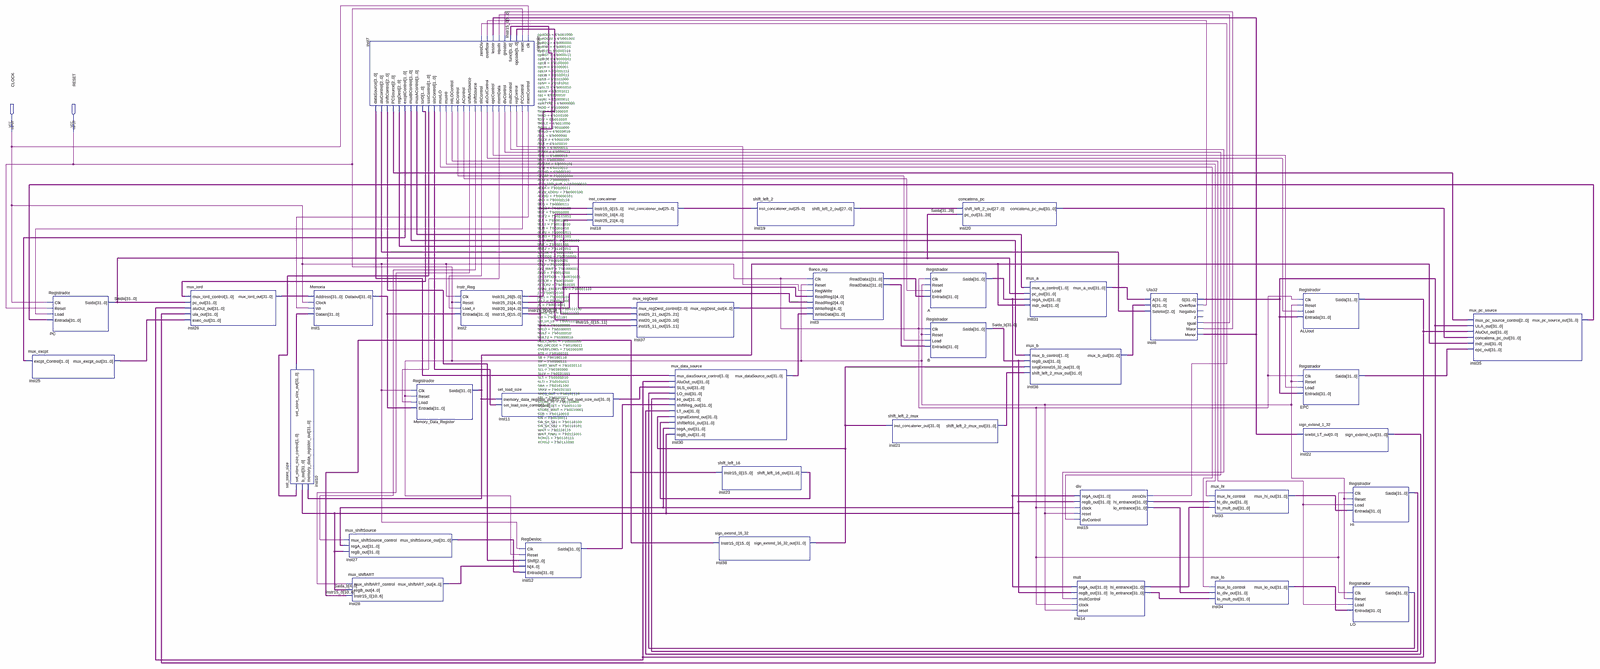
[diagram p0: schematic sheet, whole]
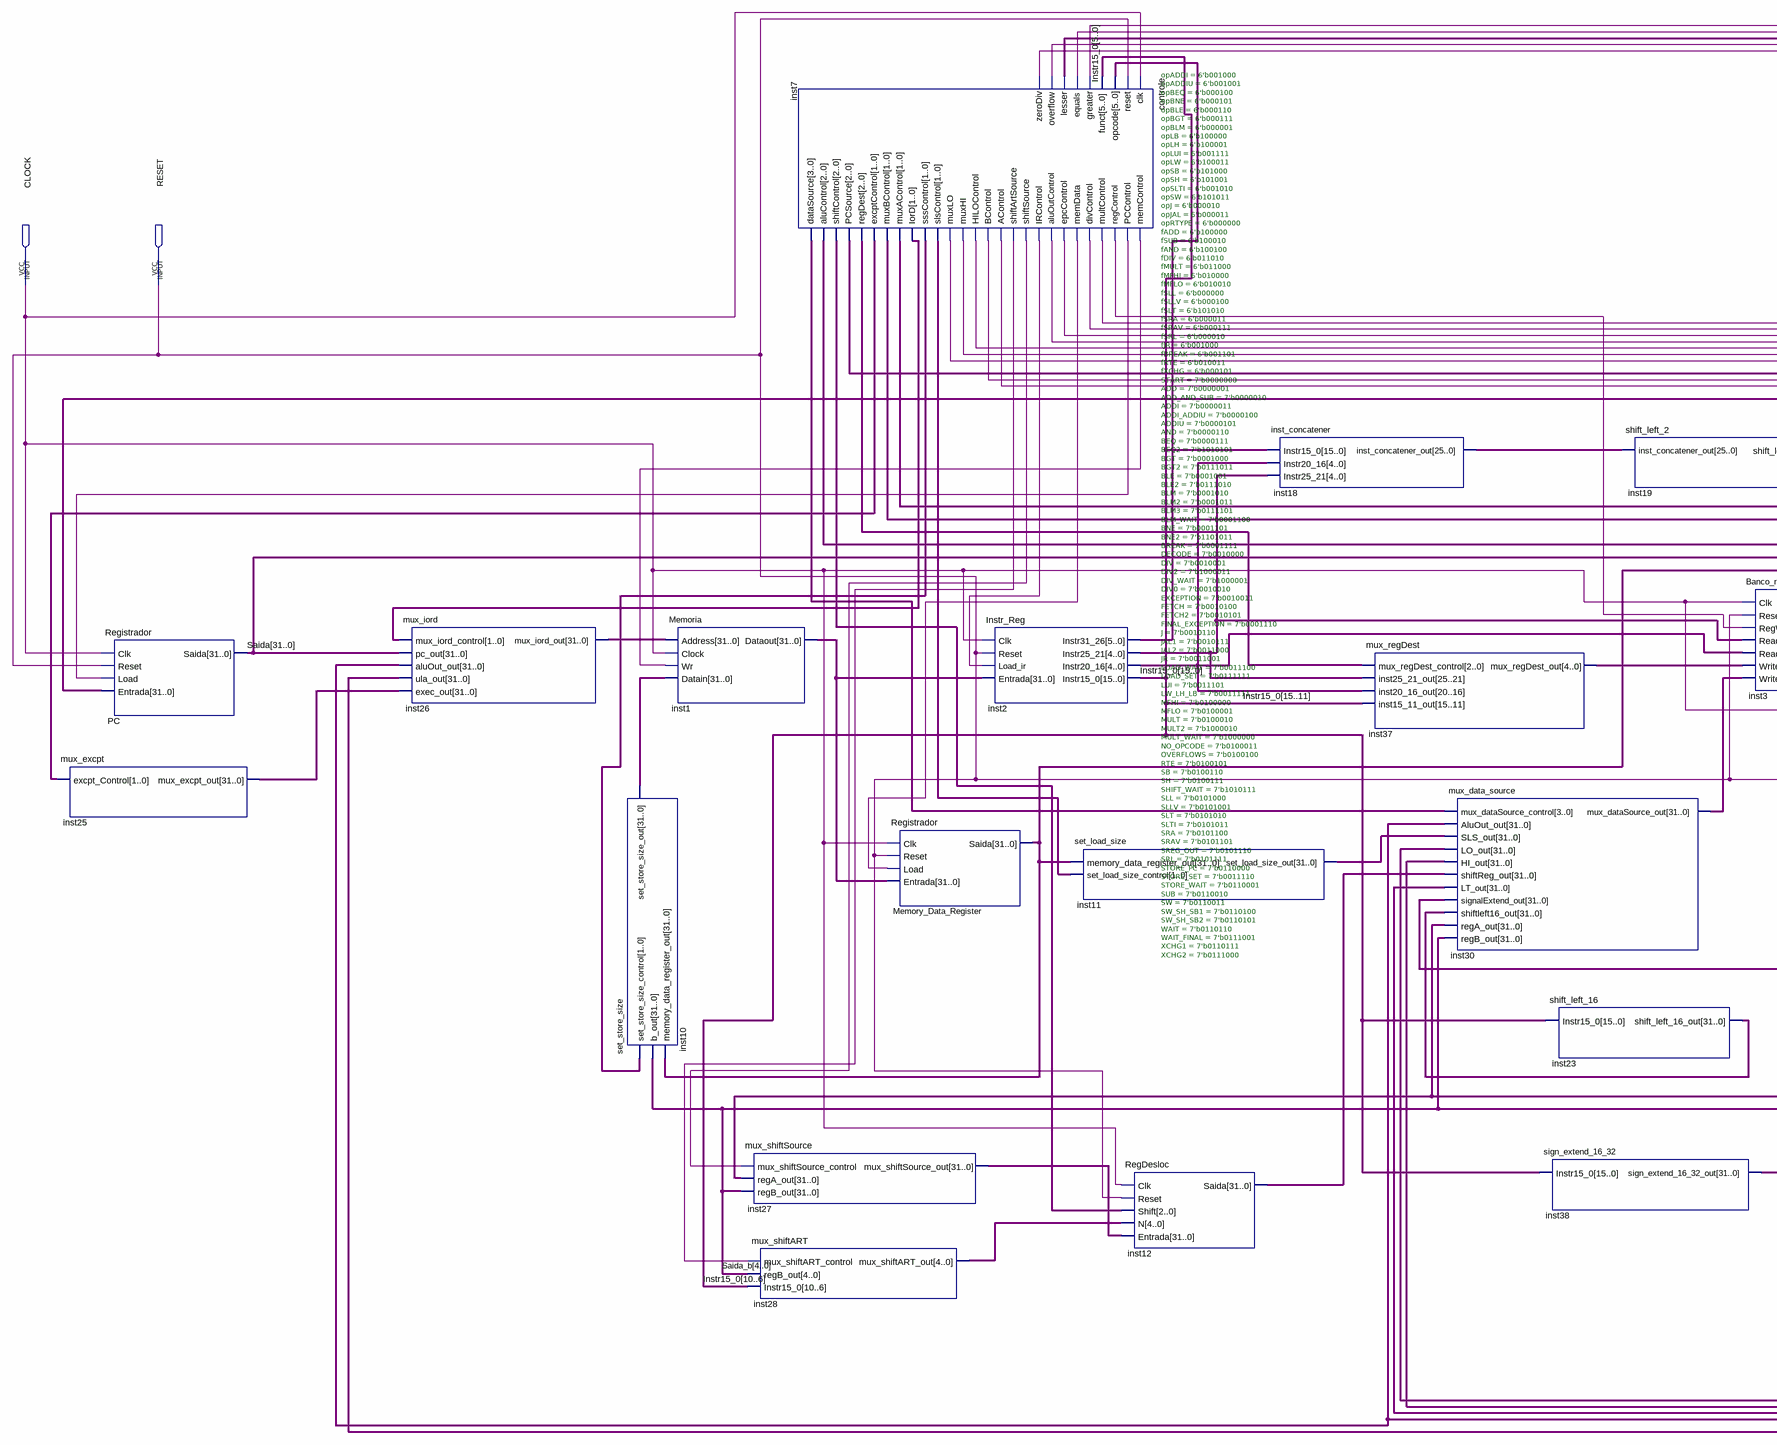
[diagram p1: schematic sheet, left part]
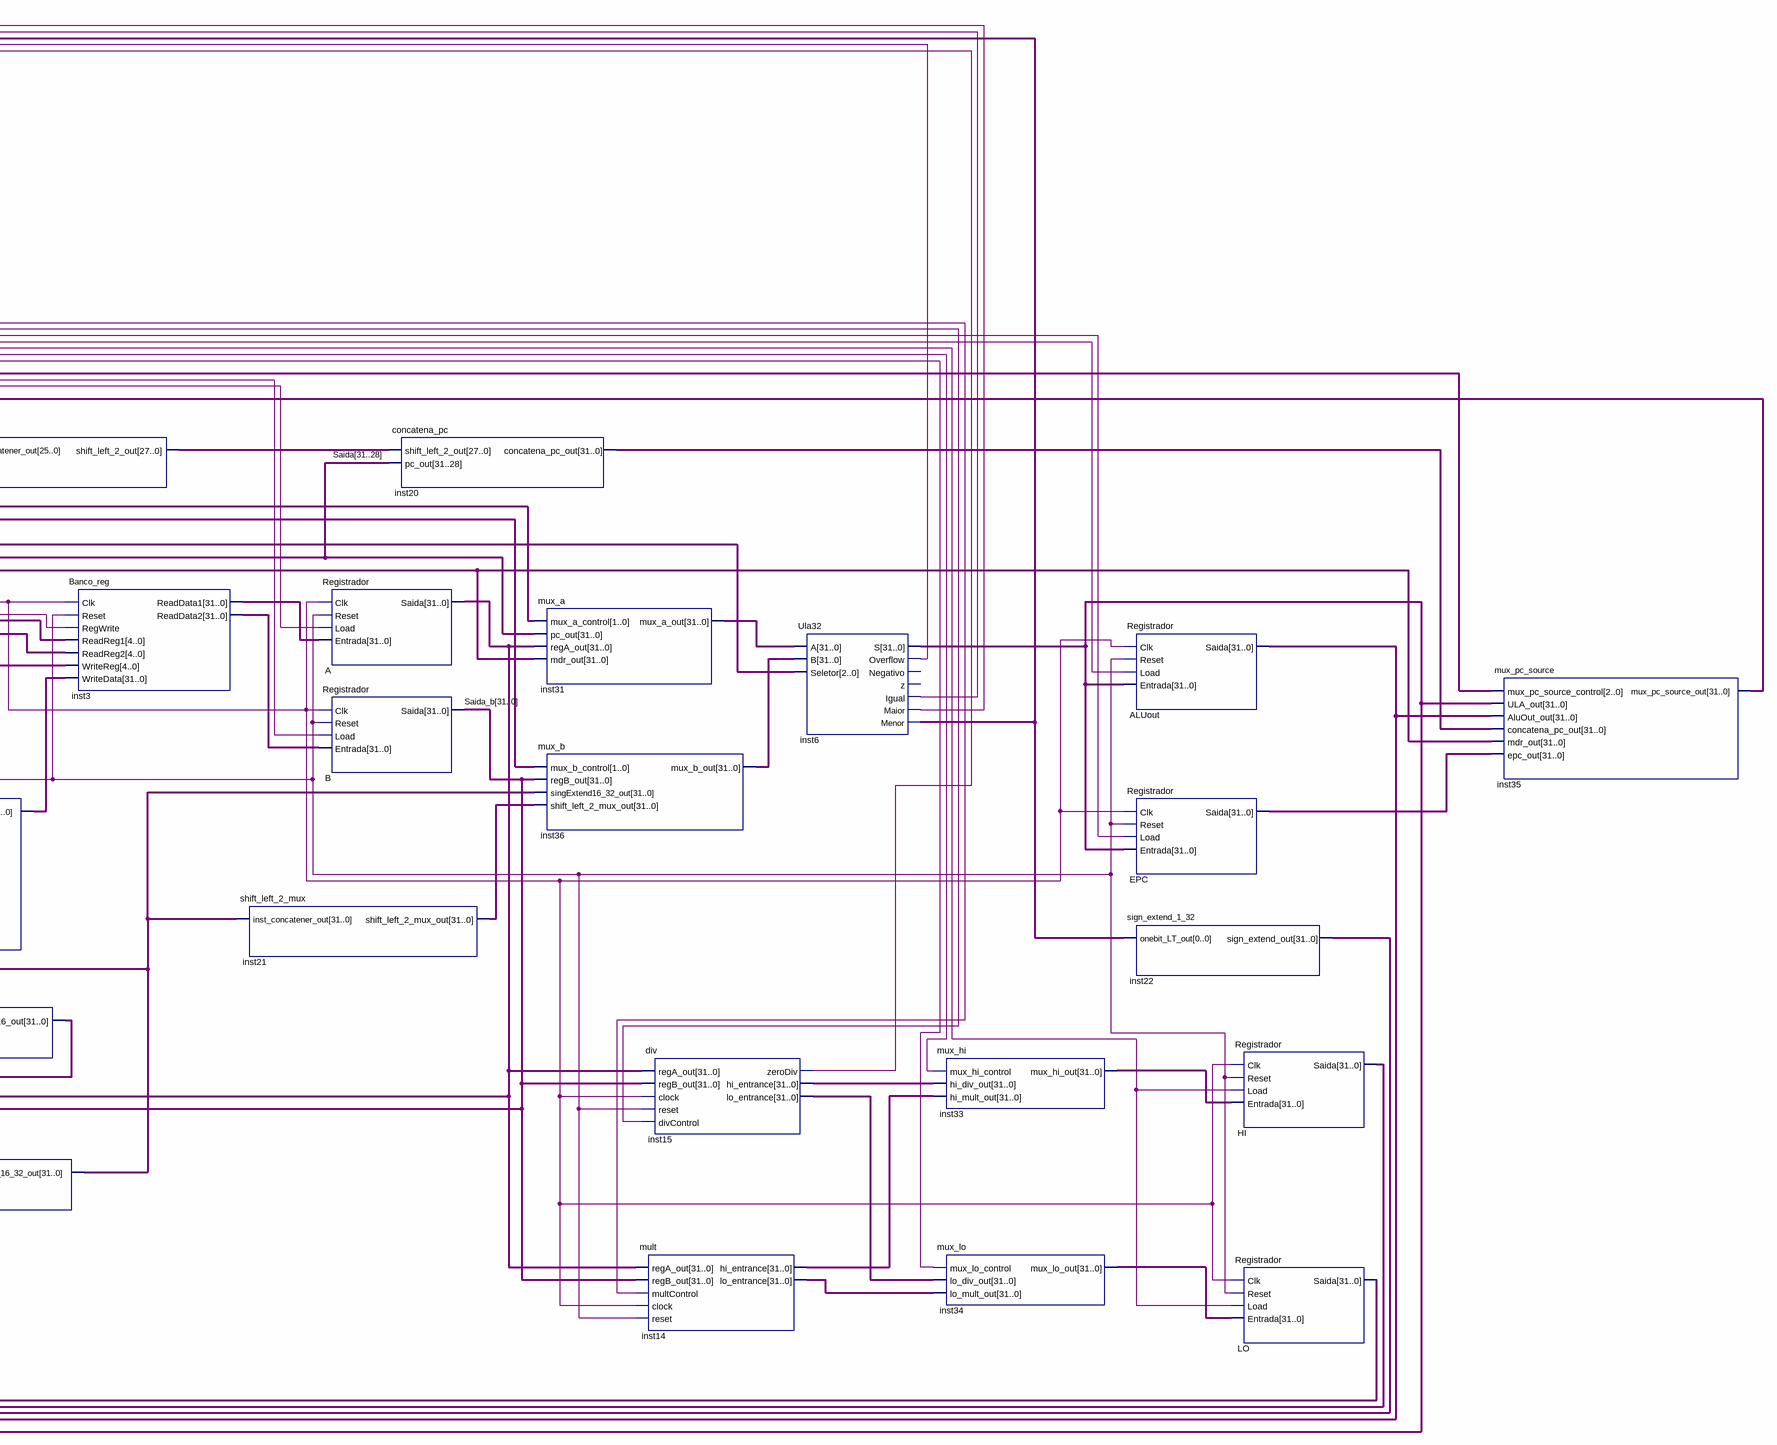
[diagram p2: schematic sheet, right part]
// Quartus schematic ProjetoInfraHard.bdf as structural Verilog: 36 symbols, 2 pins
module ProjetoInfraHard (
  input  CLOCK,
  input  RESET
);

  wire inst6_igual, inst6_maior, inst6_menor, inst6_overflow, inst7_acontrol, inst7_aluoutcontrol,
       inst7_bcontrol, inst7_divcontrol, inst7_epccontrol, inst7_hilocontrol, inst7_ircontrol,
       inst7_memcontrol, inst7_memdata, inst7_multcontrol, inst7_muxhi, inst7_muxlo, inst7_pccontrol,
       inst7_regcontrol, inst7_shiftartsource, inst7_shiftsource, inst15_zerodiv;
  wire [1:0] inst7_excptcontrol, inst7_iord, inst7_muxacontrol, inst7_muxbcontrol, inst7_slscontrol,
       inst7_ssscontrol;
  wire [2:0] inst7_alucontrol, inst7_pcsource, inst7_regdest, inst7_shiftcontrol;
  wire [3:0] inst7_datasource;
  wire [4:0] inst2_instr20_16, inst2_instr25_21, inst28_mux_shiftart_out, inst37_mux_regdest_out;
  wire [5:0] inst2_instr31_26;
  wire [15:0] Instr15_0;
  wire [25:0] inst18_inst_concatener_out;
  wire [27:0] inst19_shift_left_2_out;
  wire [31:0] A_saida, ALUout_saida, EPC_saida, HI_saida, inst1_dataout, inst3_readdata1, inst3_readdata2,
       inst6_s, inst10_set_store_size_out, inst11_set_load_size_out, inst12_saida, inst14_hi_entrance,
       inst14_lo_entrance, inst15_hi_entrance, inst15_lo_entrance, inst20_concatena_pc_out,
       inst21_shift_left_2_mux_out, inst22_sign_extend_out, inst23_shift_left_16_out, inst25_mux_excpt_out,
       inst26_mux_iord_out, inst27_mux_shiftsource_out, inst30_mux_datasource_out, inst31_mux_a_out,
       inst33_mux_hi_out, inst34_mux_lo_out, inst35_mux_pc_source_out, inst36_mux_b_out,
       inst38_sign_extend_16_32_out, LO_saida, Memory_Data_Register_saida, Saida, Saida_b;

  mux_excpt inst25 (.excpt_Control(inst7_excptcontrol), .mux_excpt_out(inst25_mux_excpt_out));
  Registrador PC (
    .Clk(CLOCK), .Reset(RESET), .Load(inst7_pccontrol), .Entrada(inst35_mux_pc_source_out), .Saida(Saida));
  mux_iord inst26 (
    .mux_iord_control(inst7_iord), .pc_out(Saida), .aluOut_out(ALUout_saida), .ula_out(inst6_s),
    .exec_out(inst25_mux_excpt_out), .mux_iord_out(inst26_mux_iord_out));
  set_store_size inst10 (
    .set_store_size_control(inst7_ssscontrol), .b_out(Saida_b),
    .memory_data_register_out(Memory_Data_Register_saida), .set_store_size_out(inst10_set_store_size_out));
  Memoria inst1 (
    .Address(inst26_mux_iord_out), .Clock(CLOCK), .Wr(inst7_memcontrol), .Datain(inst10_set_store_size_out),
    .Dataout(inst1_dataout));
  mux_shiftSource inst27 (
    .mux_shiftSource_control(inst7_shiftsource), .regA_out(A_saida), .regB_out(Saida_b),
    .mux_shiftSource_out(inst27_mux_shiftsource_out));
  mux_shiftART inst28 (
    .mux_shiftART_control(inst7_shiftartsource), .regB_out(Saida_b[4:0]), .Instr15_0(Instr15_0[10:6]),
    .mux_shiftART_out(inst28_mux_shiftart_out));
  controle #(.opADDI(6'b001000), .opADDIU(6'b001001), .opBEQ(6'b000100), .opBNE(6'b000101), .opBLE(6'b000110), .opBGT(6'b000111), .opBLM(6'b000001), .opLB(6'b100000), .opLH(6'b100001), .opLUI(6'b001111), .opLW(6'b100011), .opSB(6'b101000), .opSH(6'b101001), .opSLTI(6'b001010), .opSW(6'b101011), .opJ(6'b000010), .opJAL(6'b000011), .opRTYPE(6'b000000), .fADD(6'b100000), .fSUB(6'b100010), .fAND(6'b100100), .fDIV(6'b011010), .fMULT(6'b011000), .fMFHI(6'b010000), .fMFLO(6'b010010), .fSLL(6'b000000), .fSLLV(6'b000100), .fSLT(6'b101010), .fSRA(6'b000011), .fSRAV(6'b000111), .fSRL(6'b000010), .fJR(6'b001000), .fBREAK(6'b001101), .fRTE(6'b010011), .fXCHG(6'b000101), .START(7'b0000000), .ADD(7'b0000001), .ADD_AND_SUB(7'b0000010), .ADDI(7'b0000011), .ADDI_ADDIU(7'b0000100), .ADDIU(7'b0000101), .AND(7'b0000110), .BEQ(7'b0000111), .BEQ2(7'b1010101), .BGT(7'b0001000), .BGT2(7'b0111011), .BLE(7'b0001001), .BLE2(7'b0111010), .BLM(7'b0001010), .BLM2(7'b0001011), .BLM3(7'b0111101), .BLM_WAIT(7'b0001100), .BNE(7'b0001101), .BNE2(7'b1101011), .BREAK(7'b0001111), .DECODE(7'b0010000), .DIV(7'b0010001), .DIV2(7'b1000011), .DIV_WAIT(7'b1000001), .DIV0(7'b0010010), .EXCEPTION(7'b0010011), .FETCH(7'b0010100), .FETCH2(7'b0010101), .FINAL_EXCEPTION(7'b0001110), .J(7'b0010110), .JAL1(7'b0010111), .JAL2(7'b0011000), .JR(7'b0011001), .LOAD_WAIT(7'b0011100), .LOAD_SET(7'b0111111), .LUI(7'b0011101), .LW_LH_LB(7'b0011111), .MFHI(7'b0100000), .MFLO(7'b0100001), .MULT(7'b0100010), .MULT2(7'b1000010), .MULT_WAIT(7'b1000000), .NO_OPCODE(7'b0100011), .OVERFLOWS(7'b0100100), .RTE(7'b0100101), .SB(7'b0100110), .SH(7'b0100111), .SHIFT_WAIT(7'b1010111), .SLL(7'b0101000), .SLLV(7'b0101001), .SLT(7'b0101010), .SLTI(7'b0101011), .SRA(7'b0101100), .SRAV(7'b0101101), .SREG_OUT(7'b0101110), .SRL(7'b0101111), .STORE_PC(7'b0110000), .STORE_SET(7'b0011110), .STORE_WAIT(7'b0110001), .SUB(7'b0110010), .SW(7'b0110011), .SW_SH_SB1(7'b0110100), .SW_SH_SB2(7'b0110101), .WAIT(7'b0110110), .WAIT_FINAL(7'b0111001), .XCHG1(7'b0110111), .XCHG2(7'b0111000)) inst7 (
    .clk(CLOCK), .reset(RESET), .opcode(inst2_instr31_26), .funct(Instr15_0[5:0]), .greater(inst6_maior),
    .equals(inst6_igual), .lesser(inst6_menor), .overflow(inst6_overflow), .zeroDiv(inst15_zerodiv),
    .memControl(inst7_memcontrol), .PCControl(inst7_pccontrol), .regControl(inst7_regcontrol),
    .multControl(inst7_multcontrol), .divControl(inst7_divcontrol), .memData(inst7_memdata),
    .epcControl(inst7_epccontrol), .aluOutControl(inst7_aluoutcontrol), .IRControl(inst7_ircontrol),
    .shiftSource(inst7_shiftsource), .shiftArtSource(inst7_shiftartsource), .AControl(inst7_acontrol),
    .BControl(inst7_bcontrol), .HILOControl(inst7_hilocontrol), .muxHI(inst7_muxhi), .muxLO(inst7_muxlo),
    .slsControl(inst7_slscontrol), .sssControl(inst7_ssscontrol), .IorD(inst7_iord),
    .muxAControl(inst7_muxacontrol), .muxBControl(inst7_muxbcontrol), .excptControl(inst7_excptcontrol),
    .regDest(inst7_regdest), .PCSource(inst7_pcsource), .shiftControl(inst7_shiftcontrol),
    .aluControl(inst7_alucontrol), .dataSource(inst7_datasource));
  Registrador Memory_Data_Register (
    .Clk(CLOCK), .Reset(RESET), .Load(inst7_memdata), .Entrada(inst1_dataout),
    .Saida(Memory_Data_Register_saida));
  Instr_Reg inst2 (
    .Clk(CLOCK), .Reset(RESET), .Load_ir(inst7_ircontrol), .Entrada(inst1_dataout),
    .Instr31_26(inst2_instr31_26), .Instr25_21(inst2_instr25_21), .Instr20_16(inst2_instr20_16),
    .Instr15_0(Instr15_0));
  set_load_size inst11 (
    .memory_data_register_out(Memory_Data_Register_saida), .set_load_size_control(inst7_slscontrol),
    .set_load_size_out(inst11_set_load_size_out));
  RegDesloc inst12 (
    .Clk(CLOCK), .Reset(RESET), .Shift(inst7_shiftcontrol), .N(inst28_mux_shiftart_out),
    .Entrada(inst27_mux_shiftsource_out), .Saida(inst12_saida));
  inst_concatener inst18 (
    .Instr15_0(Instr15_0), .Instr20_16(inst2_instr20_16), .Instr25_21(inst2_instr25_21),
    .inst_concatener_out(inst18_inst_concatener_out));
  mux_regDest inst37 (
    .mux_regDest_control(inst7_regdest), .inst25_21_out(inst2_instr25_21), .inst20_16_out(inst2_instr20_16),
    .inst15_11_out(Instr15_0[15:11]), .mux_regDest_out(inst37_mux_regdest_out));
  mux_data_source inst30 (
    .mux_dataSource_control(inst7_datasource), .AluOut_out(ALUout_saida), .SLS_out(inst11_set_load_size_out),
    .LO_out(LO_saida), .HI_out(HI_saida), .shiftReg_out(inst12_saida), .LT_out(inst22_sign_extend_out),
    .signalExtend_out(inst38_sign_extend_16_32_out), .shiftleft16_out(inst23_shift_left_16_out),
    .regA_out(A_saida), .regB_out(Saida_b), .mux_dataSource_out(inst30_mux_datasource_out));
  shift_left_16 inst23 (.Instr15_0(Instr15_0), .shift_left_16_out(inst23_shift_left_16_out));
  sign_extend_16_32 inst38 (.Instr15_0(Instr15_0), .sign_extend_16_32_out(inst38_sign_extend_16_32_out));
  shift_left_2 inst19 (.inst_concatener_out(inst18_inst_concatener_out), .shift_left_2_out(inst19_shift_left_2_out));
  Banco_reg inst3 (
    .Clk(CLOCK), .Reset(RESET), .RegWrite(inst7_regcontrol), .ReadReg1(inst2_instr25_21),
    .ReadReg2(inst2_instr20_16), .WriteReg(inst37_mux_regdest_out), .WriteData(inst30_mux_datasource_out),
    .ReadData1(inst3_readdata1), .ReadData2(inst3_readdata2));
  shift_left_2_mux inst21 (
    .inst_concatener_out(inst38_sign_extend_16_32_out), .shift_left_2_mux_out(inst21_shift_left_2_mux_out));
  Registrador A (.Clk(CLOCK), .Reset(RESET), .Load(inst7_acontrol), .Entrada(inst3_readdata1), .Saida(A_saida));
  Registrador B (.Clk(CLOCK), .Reset(RESET), .Load(inst7_bcontrol), .Entrada(inst3_readdata2), .Saida(Saida_b));
  concatena_pc inst20 (
    .shift_left_2_out(inst19_shift_left_2_out), .pc_out(Saida[31:28]),
    .concatena_pc_out(inst20_concatena_pc_out));
  mux_a inst31 (
    .mux_a_control(inst7_muxacontrol), .pc_out(Saida), .regA_out(A_saida),
    .mdr_out(Memory_Data_Register_saida), .mux_a_out(inst31_mux_a_out));
  mux_b inst36 (
    .mux_b_control(inst7_muxbcontrol), .regB_out(Saida_b),
    .singExtend16_32_out(inst38_sign_extend_16_32_out), .shift_left_2_mux_out(inst21_shift_left_2_mux_out),
    .mux_b_out(inst36_mux_b_out));
  div inst15 (
    .regA_out(A_saida), .regB_out(Saida_b), .clock(CLOCK), .reset(RESET), .divControl(inst7_divcontrol),
    .zeroDiv(inst15_zerodiv), .hi_entrance(inst15_hi_entrance), .lo_entrance(inst15_lo_entrance));
  mult inst14 (
    .regA_out(A_saida), .regB_out(Saida_b), .multControl(inst7_multcontrol), .clock(CLOCK), .reset(RESET),
    .hi_entrance(inst14_hi_entrance), .lo_entrance(inst14_lo_entrance));
  Ula32 inst6 (
    .A(inst31_mux_a_out), .B(inst36_mux_b_out), .Seletor(inst7_alucontrol), .S(inst6_s),
    .Overflow(inst6_overflow), .Igual(inst6_igual), .Maior(inst6_maior), .Menor(inst6_menor));  // open: Negativo, z
  mux_hi inst33 (
    .mux_hi_control(inst7_muxhi), .hi_div_out(inst15_hi_entrance), .hi_mult_out(inst14_hi_entrance),
    .mux_hi_out(inst33_mux_hi_out));
  mux_lo inst34 (
    .mux_lo_control(inst7_muxlo), .lo_div_out(inst15_lo_entrance), .lo_mult_out(inst14_lo_entrance),
    .mux_lo_out(inst34_mux_lo_out));
  Registrador ALUout (.Clk(CLOCK), .Reset(RESET), .Load(inst7_aluoutcontrol), .Entrada(inst6_s), .Saida(ALUout_saida));
  Registrador EPC (.Clk(CLOCK), .Reset(RESET), .Load(inst7_epccontrol), .Entrada(inst6_s), .Saida(EPC_saida));
  sign_extend_1_32 inst22 (.onebit_LT_out(inst6_menor), .sign_extend_out(inst22_sign_extend_out));
  Registrador HI (.Clk(CLOCK), .Reset(RESET), .Load(inst7_hilocontrol), .Entrada(inst33_mux_hi_out), .Saida(HI_saida));
  Registrador LO (.Clk(CLOCK), .Reset(RESET), .Load(inst7_hilocontrol), .Entrada(inst34_mux_lo_out), .Saida(LO_saida));
  mux_pc_source inst35 (
    .mux_pc_source_control(inst7_pcsource), .ULA_out(inst6_s), .AluOut_out(ALUout_saida),
    .concatena_pc_out(inst20_concatena_pc_out), .mdr_out(Memory_Data_Register_saida), .epc_out(EPC_saida),
    .mux_pc_source_out(inst35_mux_pc_source_out));
endmodule
